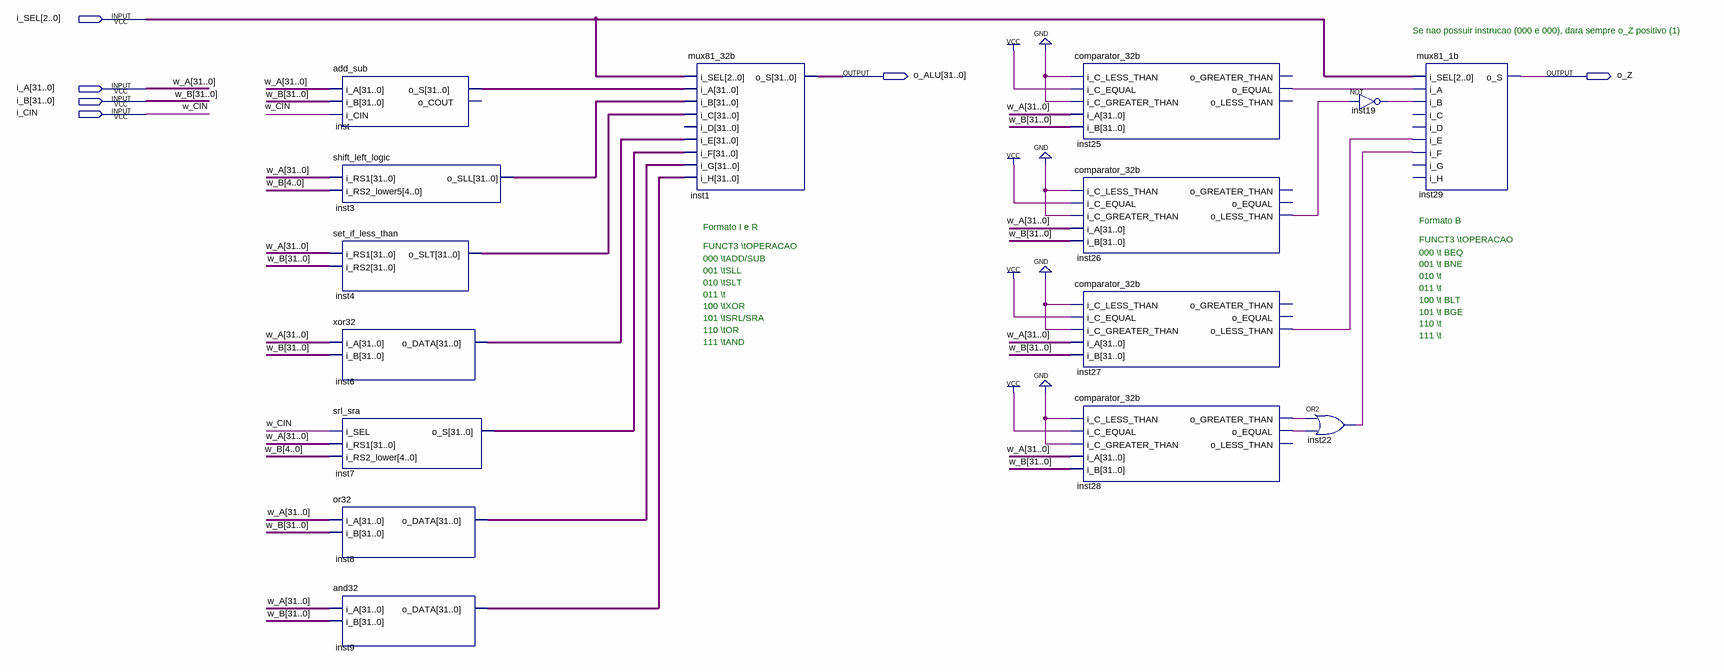
[diagram p0: schematic sheet]
// Quartus schematic alu.bdf as structural Verilog: 15 symbols, 6 pins
module alu (
  input  [2:0] i_SEL,
  input  [31:0] i_A,
  input  [31:0] i_B,
  input  i_CIN,
  output [31:0] o_ALU,
  output o_Z
);

  wire inst19_out, inst22_out, inst25_o_equal, inst26_o_less_than, inst27_o_less_than, inst28_o_equal,
       inst28_o_greater_than;
  wire [31:0] inst3_o_sll, inst4_o_slt, inst6_o_data, inst7_o_s, inst8_o_data, inst9_o_data, inst_o_s;

  add_sub inst (.i_A(i_A), .i_B(i_B), .i_CIN(i_CIN), .o_S(inst_o_s));  // open: o_COUT
  shift_left_logic inst3 (.i_RS1(i_A), .i_RS2_lower5(i_B[4:0]), .o_SLL(inst3_o_sll));
  set_if_less_than inst4 (.i_RS1(i_A), .i_RS2(i_B), .o_SLT(inst4_o_slt));
  xor32 inst6 (.i_A(i_A), .i_B(i_B), .o_DATA(inst6_o_data));
  srl_sra inst7 (.i_SEL(i_CIN), .i_RS1(i_A), .i_RS2_lower(i_B[4:0]), .o_S(inst7_o_s));
  or32 inst8 (.i_A(i_A), .i_B(i_B), .o_DATA(inst8_o_data));
  and32 inst9 (.i_A(i_A), .i_B(i_B), .o_DATA(inst9_o_data));
  mux81_32b inst1 (
    .i_SEL(i_SEL), .i_A(inst_o_s), .i_B(inst3_o_sll), .i_C(inst4_o_slt), .i_E(inst6_o_data), .i_F(inst7_o_s),
    .i_G(inst8_o_data), .i_H(inst9_o_data), .o_S(o_ALU));  // open: i_D
  comparator_32b inst25 (
    .i_C_LESS_THAN(1'b0), .i_C_EQUAL(1'b1), .i_C_GREATER_THAN(1'b0), .i_A(i_A), .i_B(i_B),
    .o_EQUAL(inst25_o_equal));  // open: o_GREATER_THAN, o_LESS_THAN
  comparator_32b inst26 (
    .i_C_LESS_THAN(1'b0), .i_C_EQUAL(1'b1), .i_C_GREATER_THAN(1'b0), .i_A(i_A), .i_B(i_B),
    .o_LESS_THAN(inst26_o_less_than));  // open: o_GREATER_THAN, o_EQUAL
  comparator_32b inst27 (
    .i_C_LESS_THAN(1'b0), .i_C_EQUAL(1'b1), .i_C_GREATER_THAN(1'b0), .i_A(i_A), .i_B(i_B),
    .o_LESS_THAN(inst27_o_less_than));  // open: o_GREATER_THAN, o_EQUAL
  comparator_32b inst28 (
    .i_C_LESS_THAN(1'b0), .i_C_EQUAL(1'b1), .i_C_GREATER_THAN(1'b0), .i_A(i_A), .i_B(i_B),
    .o_GREATER_THAN(inst28_o_greater_than), .o_EQUAL(inst28_o_equal));  // open: o_LESS_THAN
  or inst22 (inst22_out, inst28_o_greater_than, inst28_o_equal);
  not inst19 (inst19_out, inst26_o_less_than);
  mux81_1b inst29 (
    .i_SEL(i_SEL), .i_A(inst25_o_equal), .i_B(inst19_out), .i_E(inst27_o_less_than), .i_F(inst22_out),
    .o_S(o_Z));  // open: i_C, i_D, i_G, i_H

  // Other names for the same wires on the sheet: w_A[31:0] = i_A; w_B[31:0] = i_B; w_CIN = i_CIN

  // Notes on the sheet:
  //   Se nao possuir instrucao (000 e 000), dara sempre o_Z positivo (1)
  //   Formato B
  //   Formato I e R
  //   FUNCT3 \tOPERACAO
  //   FUNCT3 \tOPERACAO
  //   000 \t BEQ
  //   000 \tADD/SUB
  //   001 \t BNE
  //   001 \tSLL
  //   010 \t 
  //   010 \tSLT
  //   011 \t 
  //   011 \t 
  //   100 \t BLT
  //   100 \tXOR
  //   101 \t BGE
  //   101 \tSRL/SRA
  //   110 \t 
  //   110 \tOR
  //   111 \t 
  //   111 \tAND
endmodule
